# EAGLE design modtest (EAGLE 9.6.2)
Assembly variants: basic

## Sheet 1 of 2: Measuring part and main connector
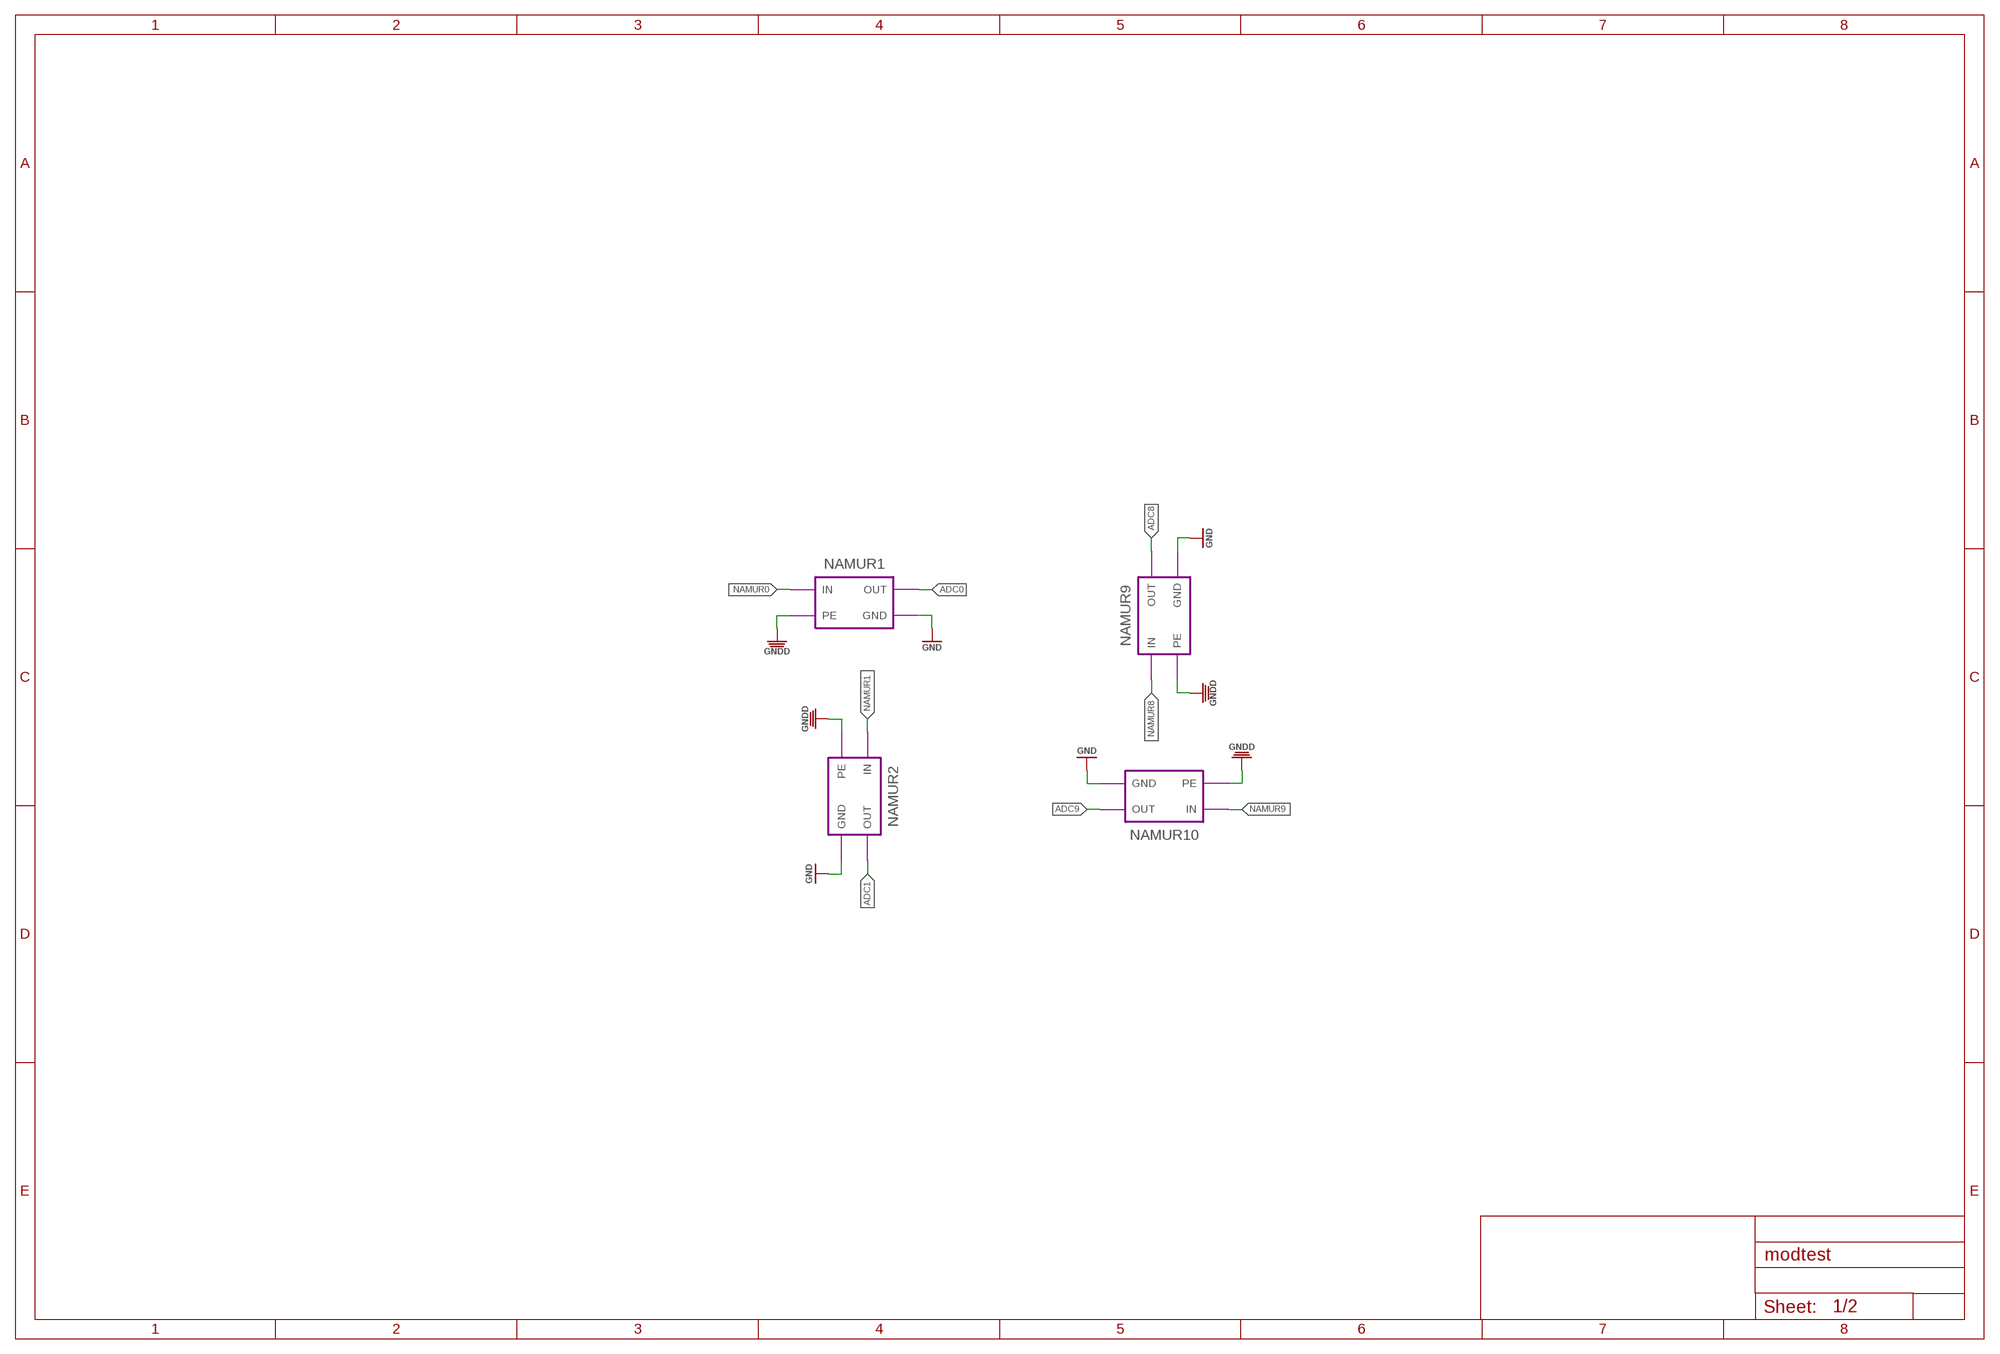
[diagram p0: schematic, sheet 1]

### Module instances
NAMUR1 = NAMUR (part numbers offset by 100)
NAMUR2 = NAMUR (part numbers offset by 200)
NAMUR9 = NAMUR (part numbers offset by 900)
NAMUR10 = NAMUR (part numbers offset by 1000)

### Nets
ADC0: port NAMUR1.OUT ; also sheet 2
ADC1: port NAMUR2.OUT ; also sheet 2
ADC8: port NAMUR9.OUT ; also sheet 2
ADC9: port NAMUR10.OUT ; also sheet 2
GND: port NAMUR1.GND NAMUR2.GND NAMUR9.GND NAMUR10.GND ; also sheet 2
GNDD: port NAMUR1.PE NAMUR2.PE NAMUR9.PE NAMUR10.PE ; also sheet 2
NAMUR0: port NAMUR1.IN ; also sheet 2
NAMUR1: port NAMUR2.IN ; also sheet 2
NAMUR8: port NAMUR9.IN ; also sheet 2
NAMUR9: port NAMUR10.IN ; also sheet 2

## Sheet 2 of 2
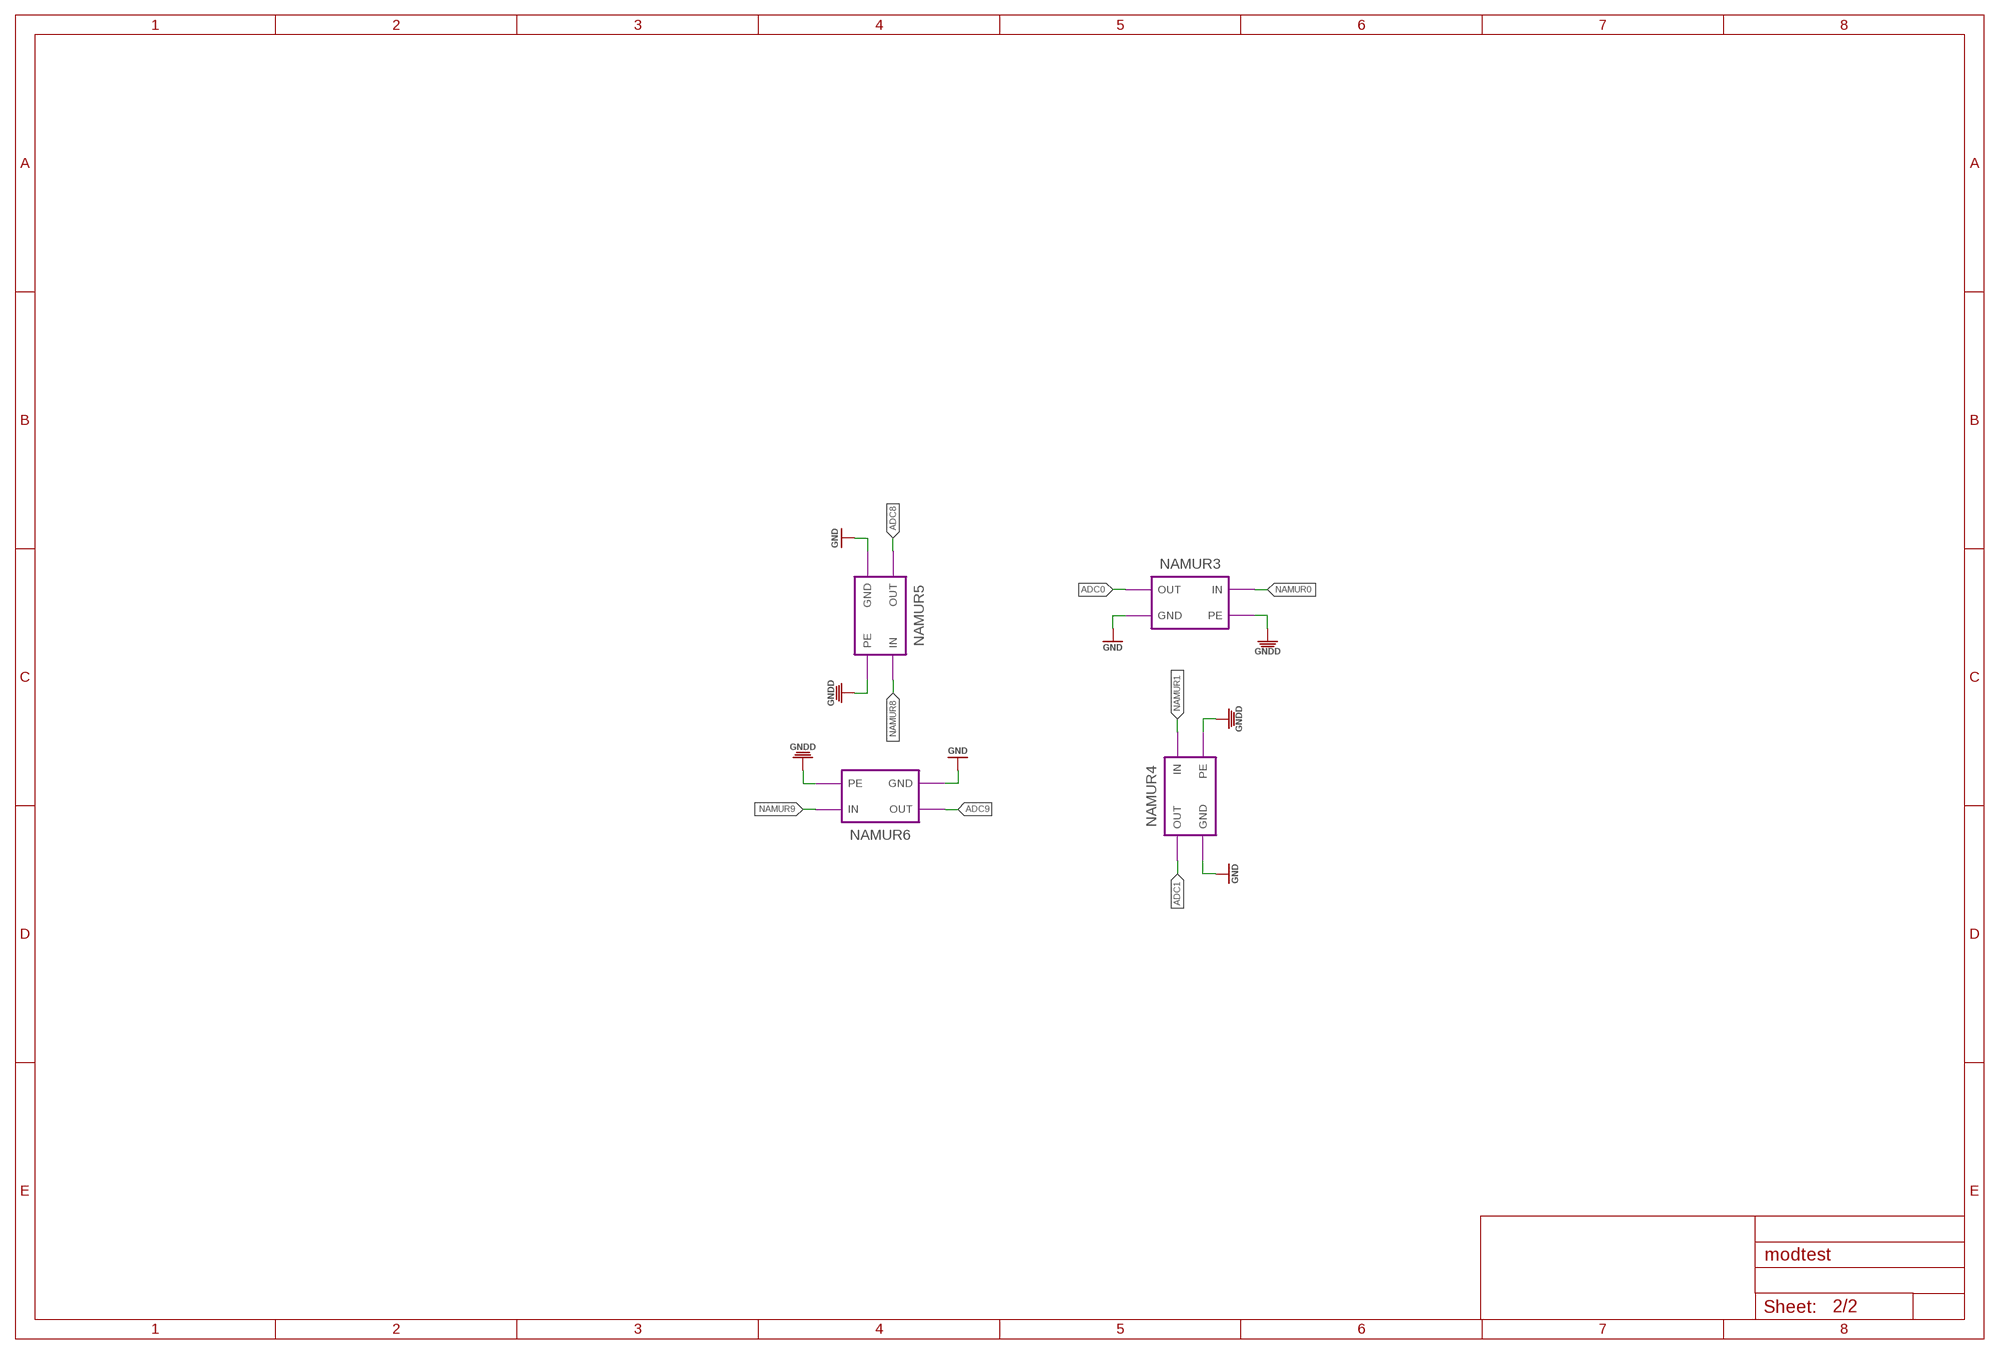
[diagram p1: schematic, sheet 2]

### Module instances
NAMUR3 = NAMUR
NAMUR4 = NAMUR
NAMUR5 = NAMUR
NAMUR6 = NAMUR

### Nets
ADC0: port NAMUR3.OUT ; also sheet 1
ADC1: port NAMUR4.OUT ; also sheet 1
ADC8: port NAMUR5.OUT ; also sheet 1
ADC9: port NAMUR6.OUT ; also sheet 1
GND: port NAMUR3.GND NAMUR4.GND NAMUR5.GND NAMUR6.GND ; also sheet 1
GNDD: port NAMUR3.PE NAMUR4.PE NAMUR5.PE NAMUR6.PE ; also sheet 1
NAMUR0: port NAMUR3.IN ; also sheet 1
NAMUR1: port NAMUR4.IN ; also sheet 1
NAMUR8: port NAMUR5.IN ; also sheet 1
NAMUR9: port NAMUR6.IN ; also sheet 1

## Library data of the parts

## Module NAMUR
Ports: GND(pwr) IN(in) OUT(out) PE(pwr)
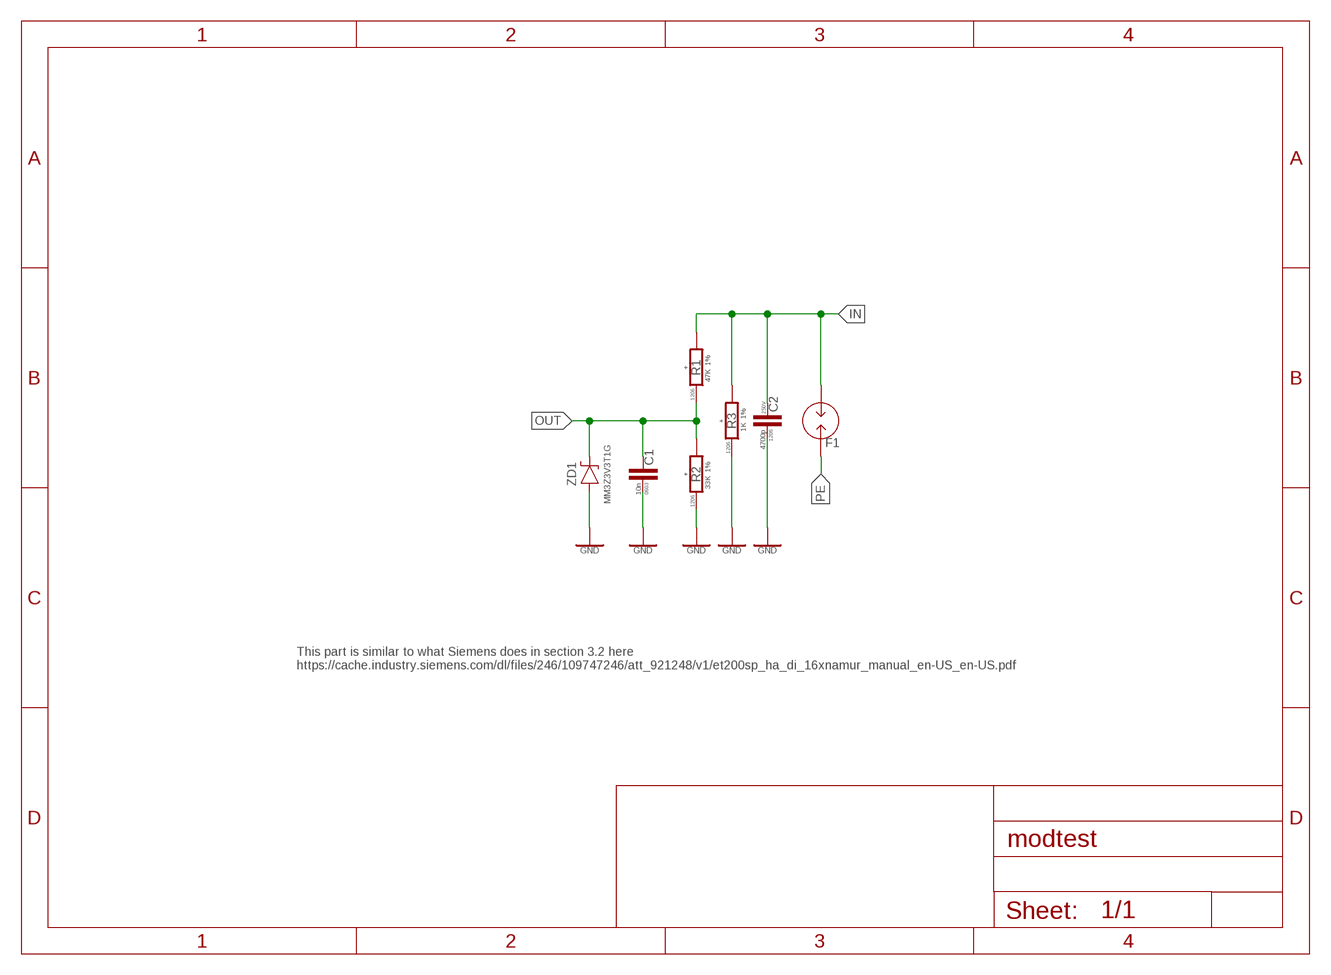
[diagram p2: schematic, module NAMUR, sheet 1]

### Parts
C1  10n  C-0603  [C0603]
C2  4700p  C-1206  [C1206]
F1  SURGE_ARRESTER-S30-A90X  [S30-A90X]
R1  47K  R-1%-1206  [R1206]
R2  33K  R-1%-1206  [R1206]
R3  1K  R-1%-1206  [R1206]
ZD1  MM3Z3V3  [SOD323]

### Nets
GND: C1.1 C2.P$1 R2.P$1 R3.P$1 ZD1.A
IN: C2.P$2 F1.1 R1.P$2 R3.P$2
OUT: C1.2 R1.P$1 R2.P$2 ZD1.C
PE: F1.2

### Notes on the sheet
- This part is similar to what Siemens does in section 3.2 here
  https://cache.industry.siemens.com/dl/files/246/109747246/att_921248/v1/et200sp_ha_di_16xnamur_manual_en-US_en-US.pdf

### Library data of the parts
C1 = rc:C; PACKAGE: 0603; RU: Конденсатор керамический SMD 0603
C2 = rc:C; PACKAGE: 1206; RU: Конденсатор керамический SMD 1206; VOLTAGE: 250V
F1 = rc:SURGE_ARRESTER: S30-A90X Surge arrester; CODE: 00000040342; LCSC#: C3660985; MANF: TDK; MANF#: B88069X9231T253; RU: Газоразрядник S30-A90X (90V, 2kA, 2 вывода, SMD1812)
R1-R3 = rc:R; ALLOCATED: +; PACKAGE: 1206; TOLERANCE: 1%
ZD1 = Diodes:MM3Z: Zener Diode 200-300mW ±6% Surface Mount SOD-323 (or SOD-323FL); LCSC#: C75073; MANF: onsemi; MANF#: MM3Z3V3T1G

## Net classes
1 HV: clearance 0.3 mm to class 0, clearance 0.3 mm

## Board
ВНАР.301411.138 Сателлит-Р. Плата субблока ВТИ-8 (Р05)
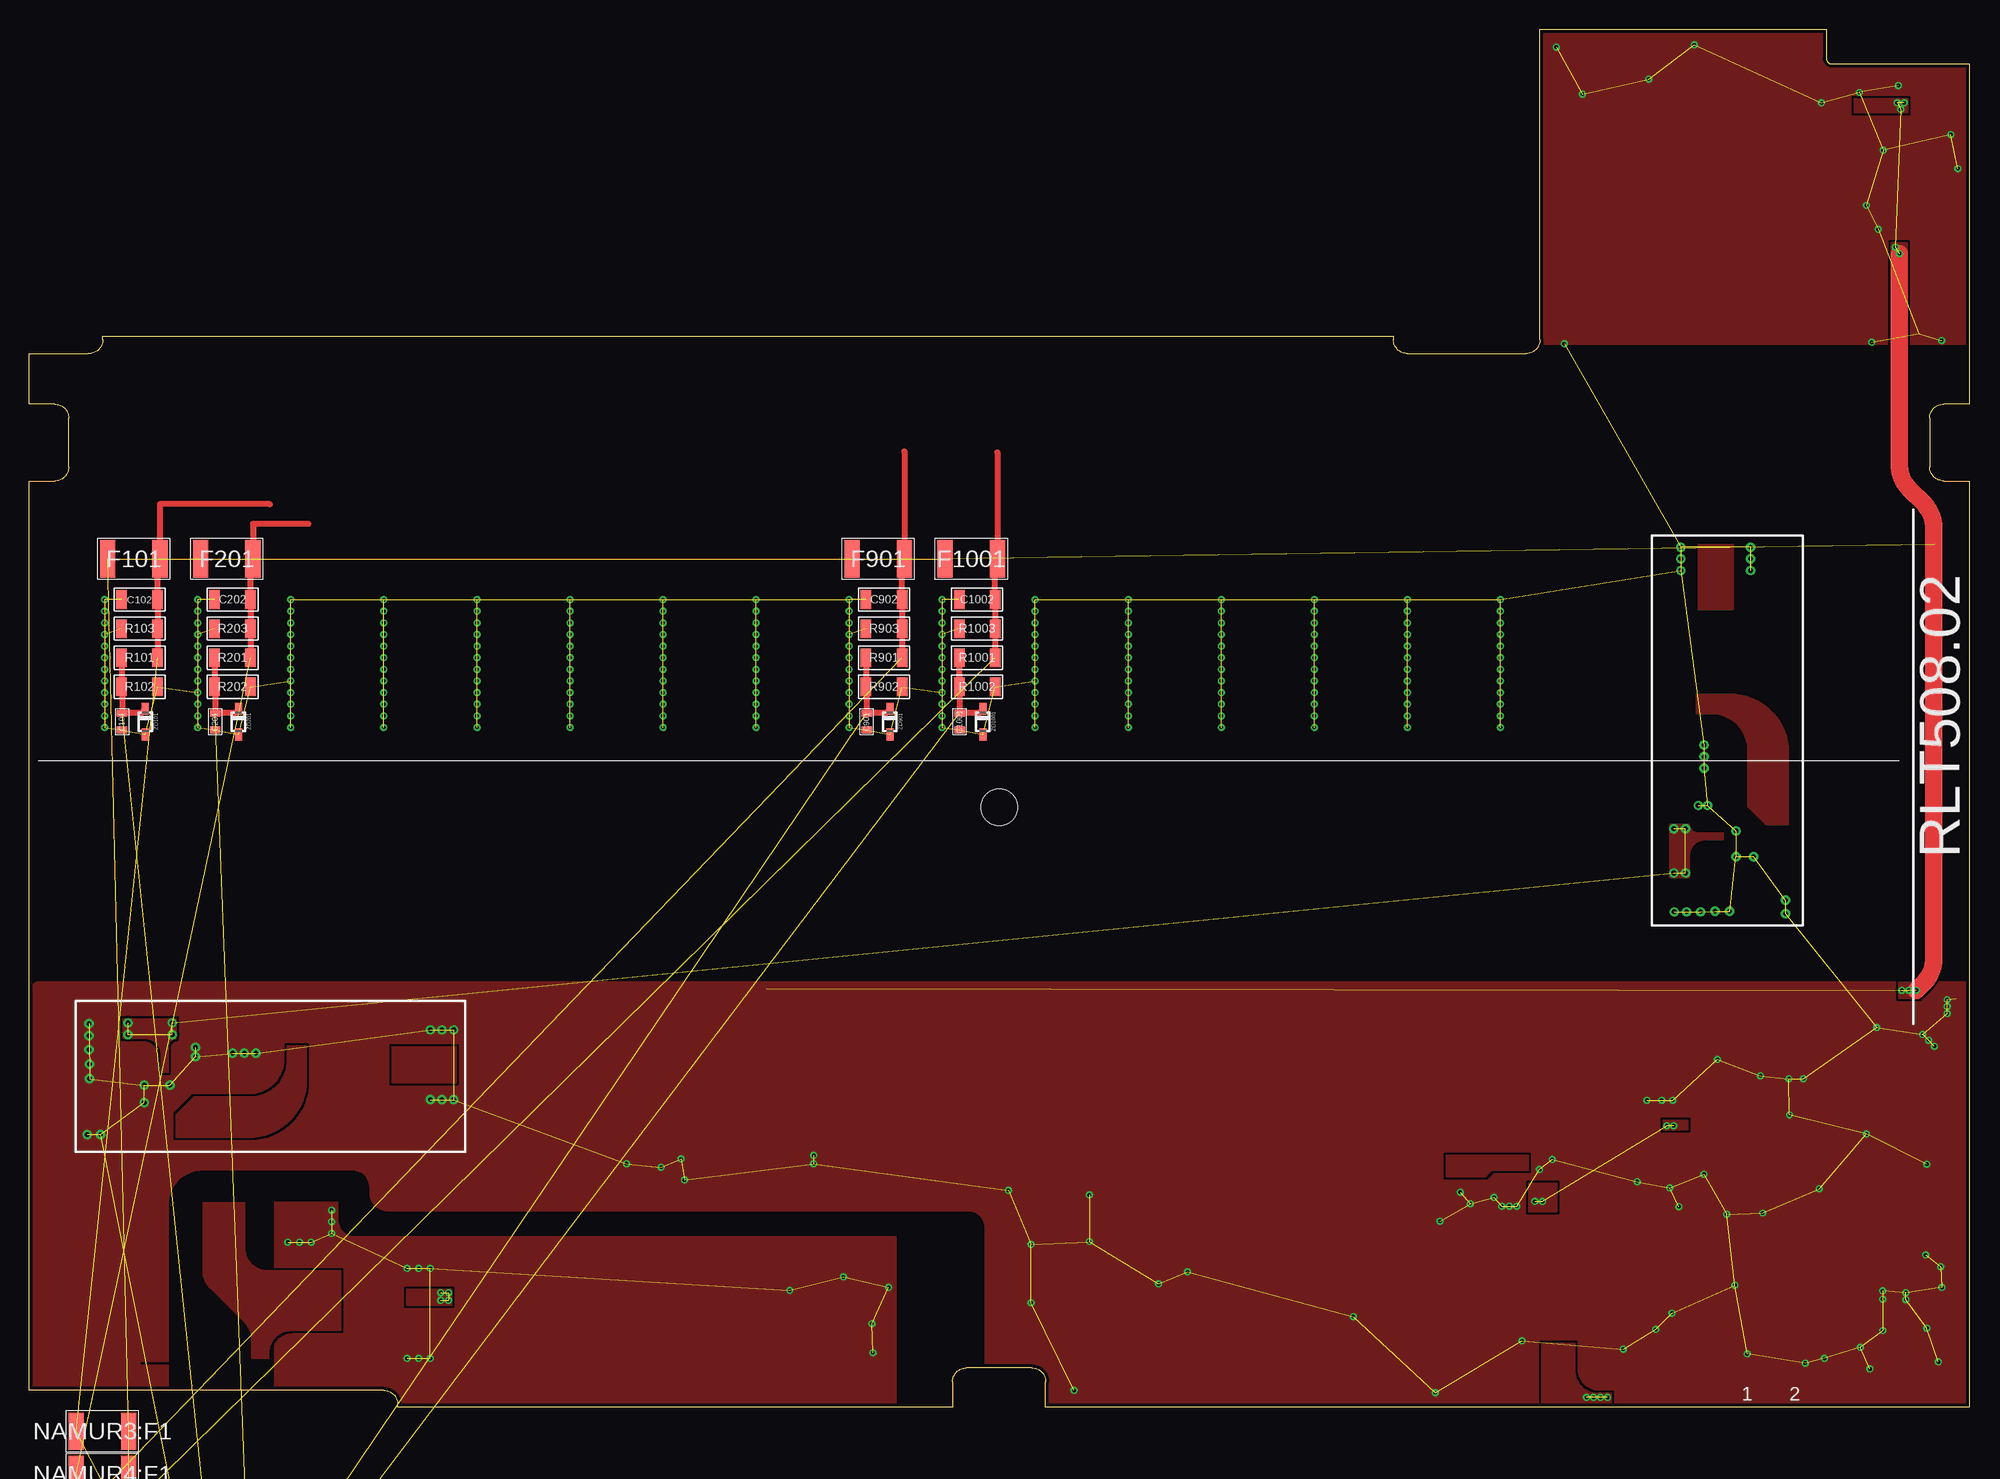
[diagram p3: board, top side]
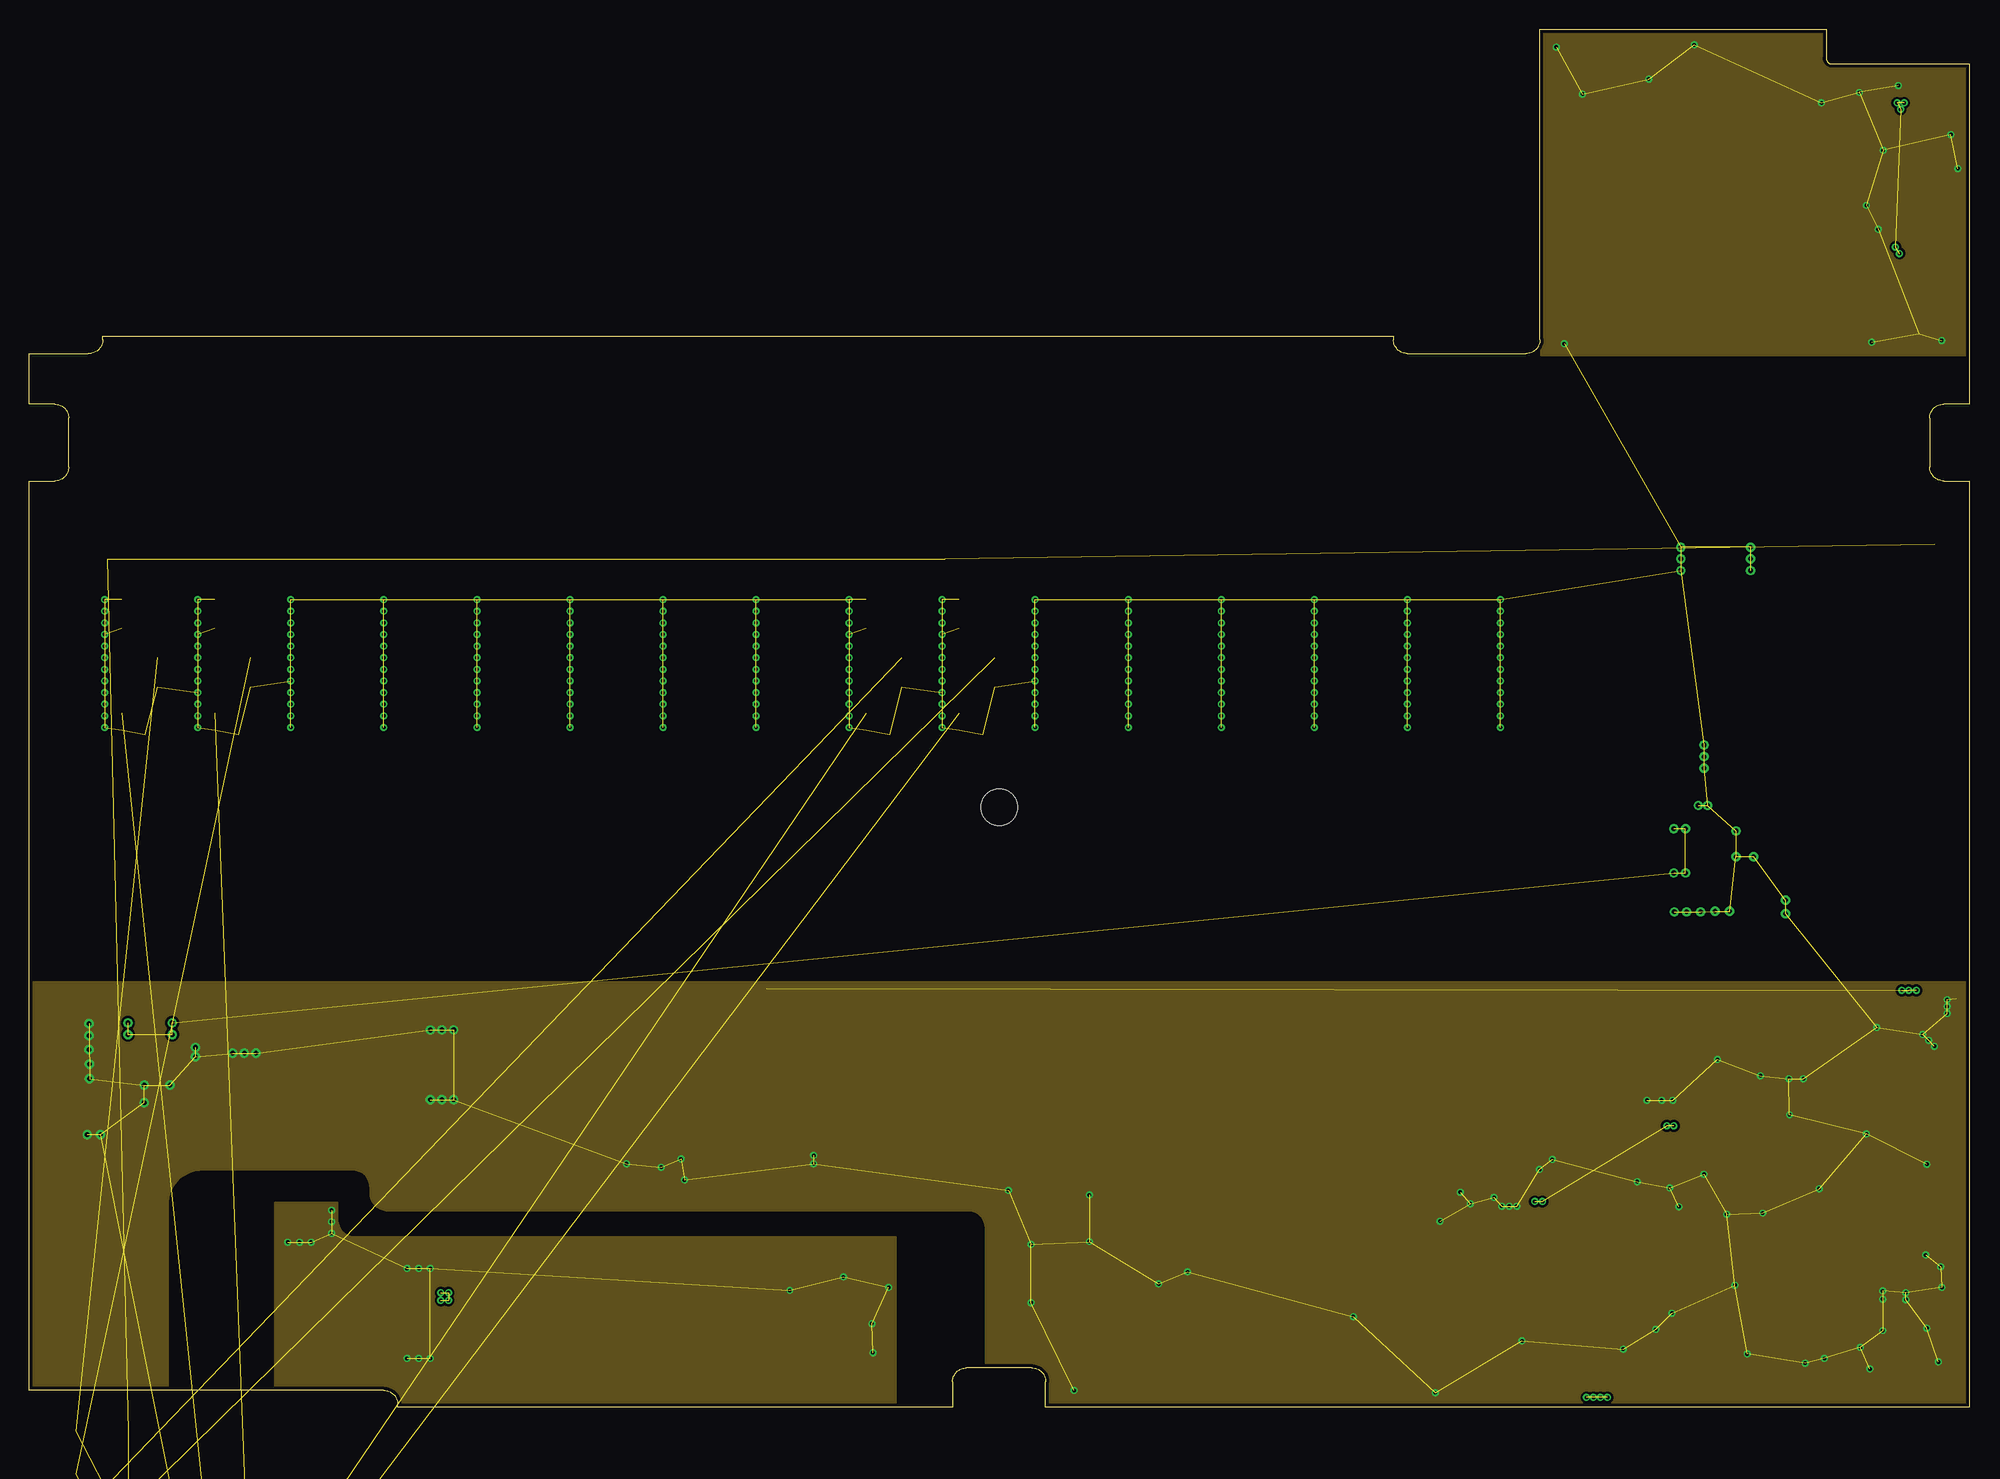
[diagram p4: board, inner layer Route2]
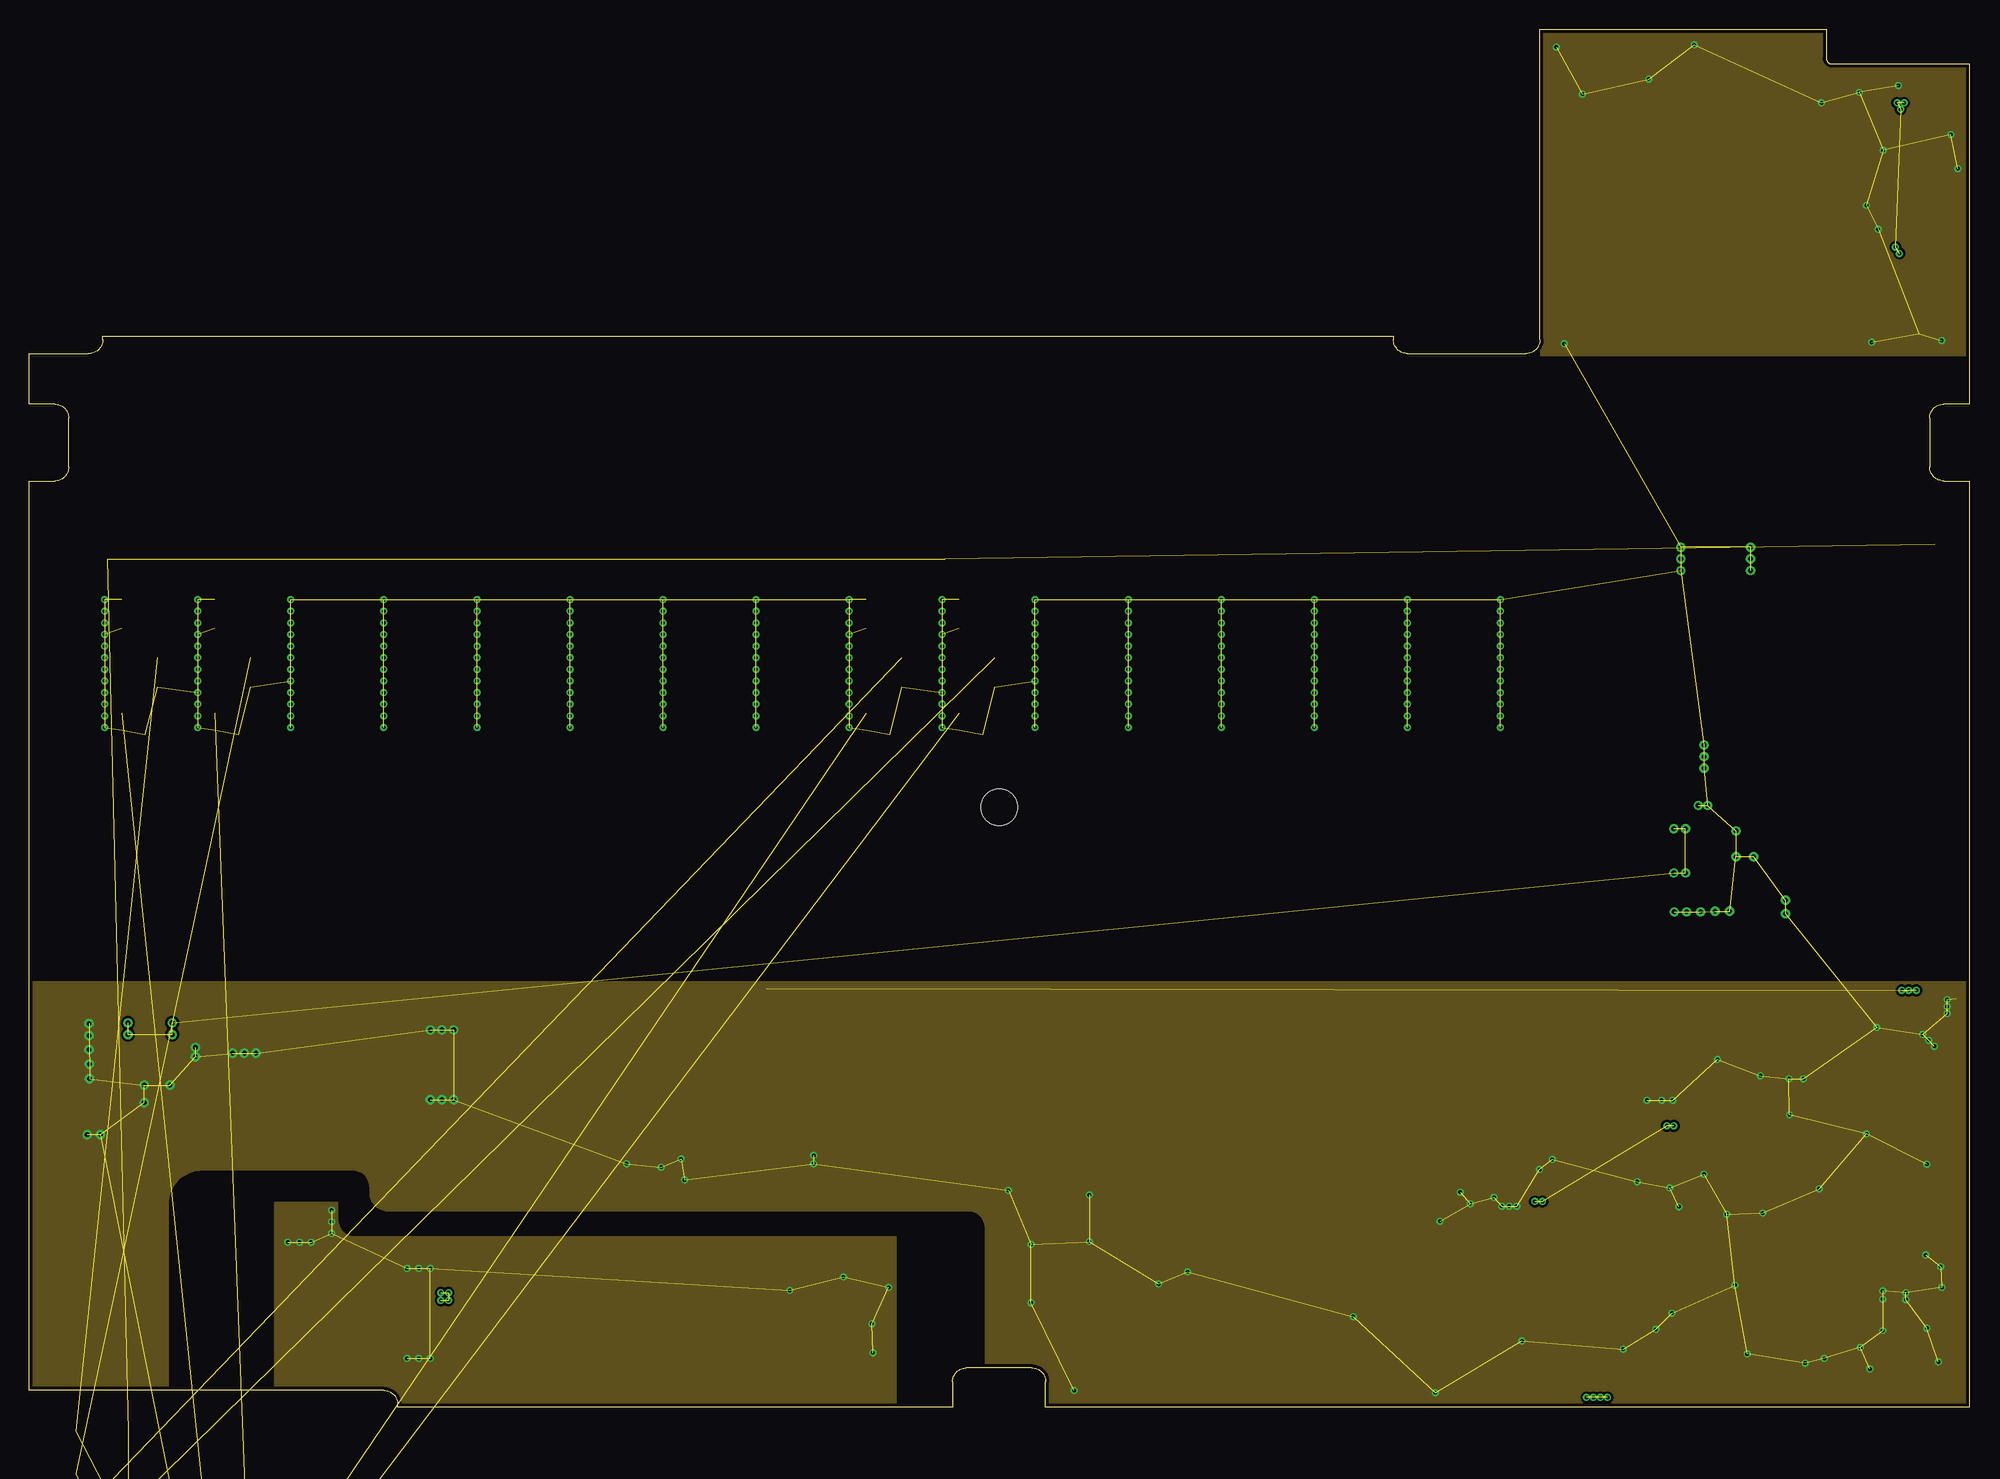
[diagram p5: board, inner layer Route15]
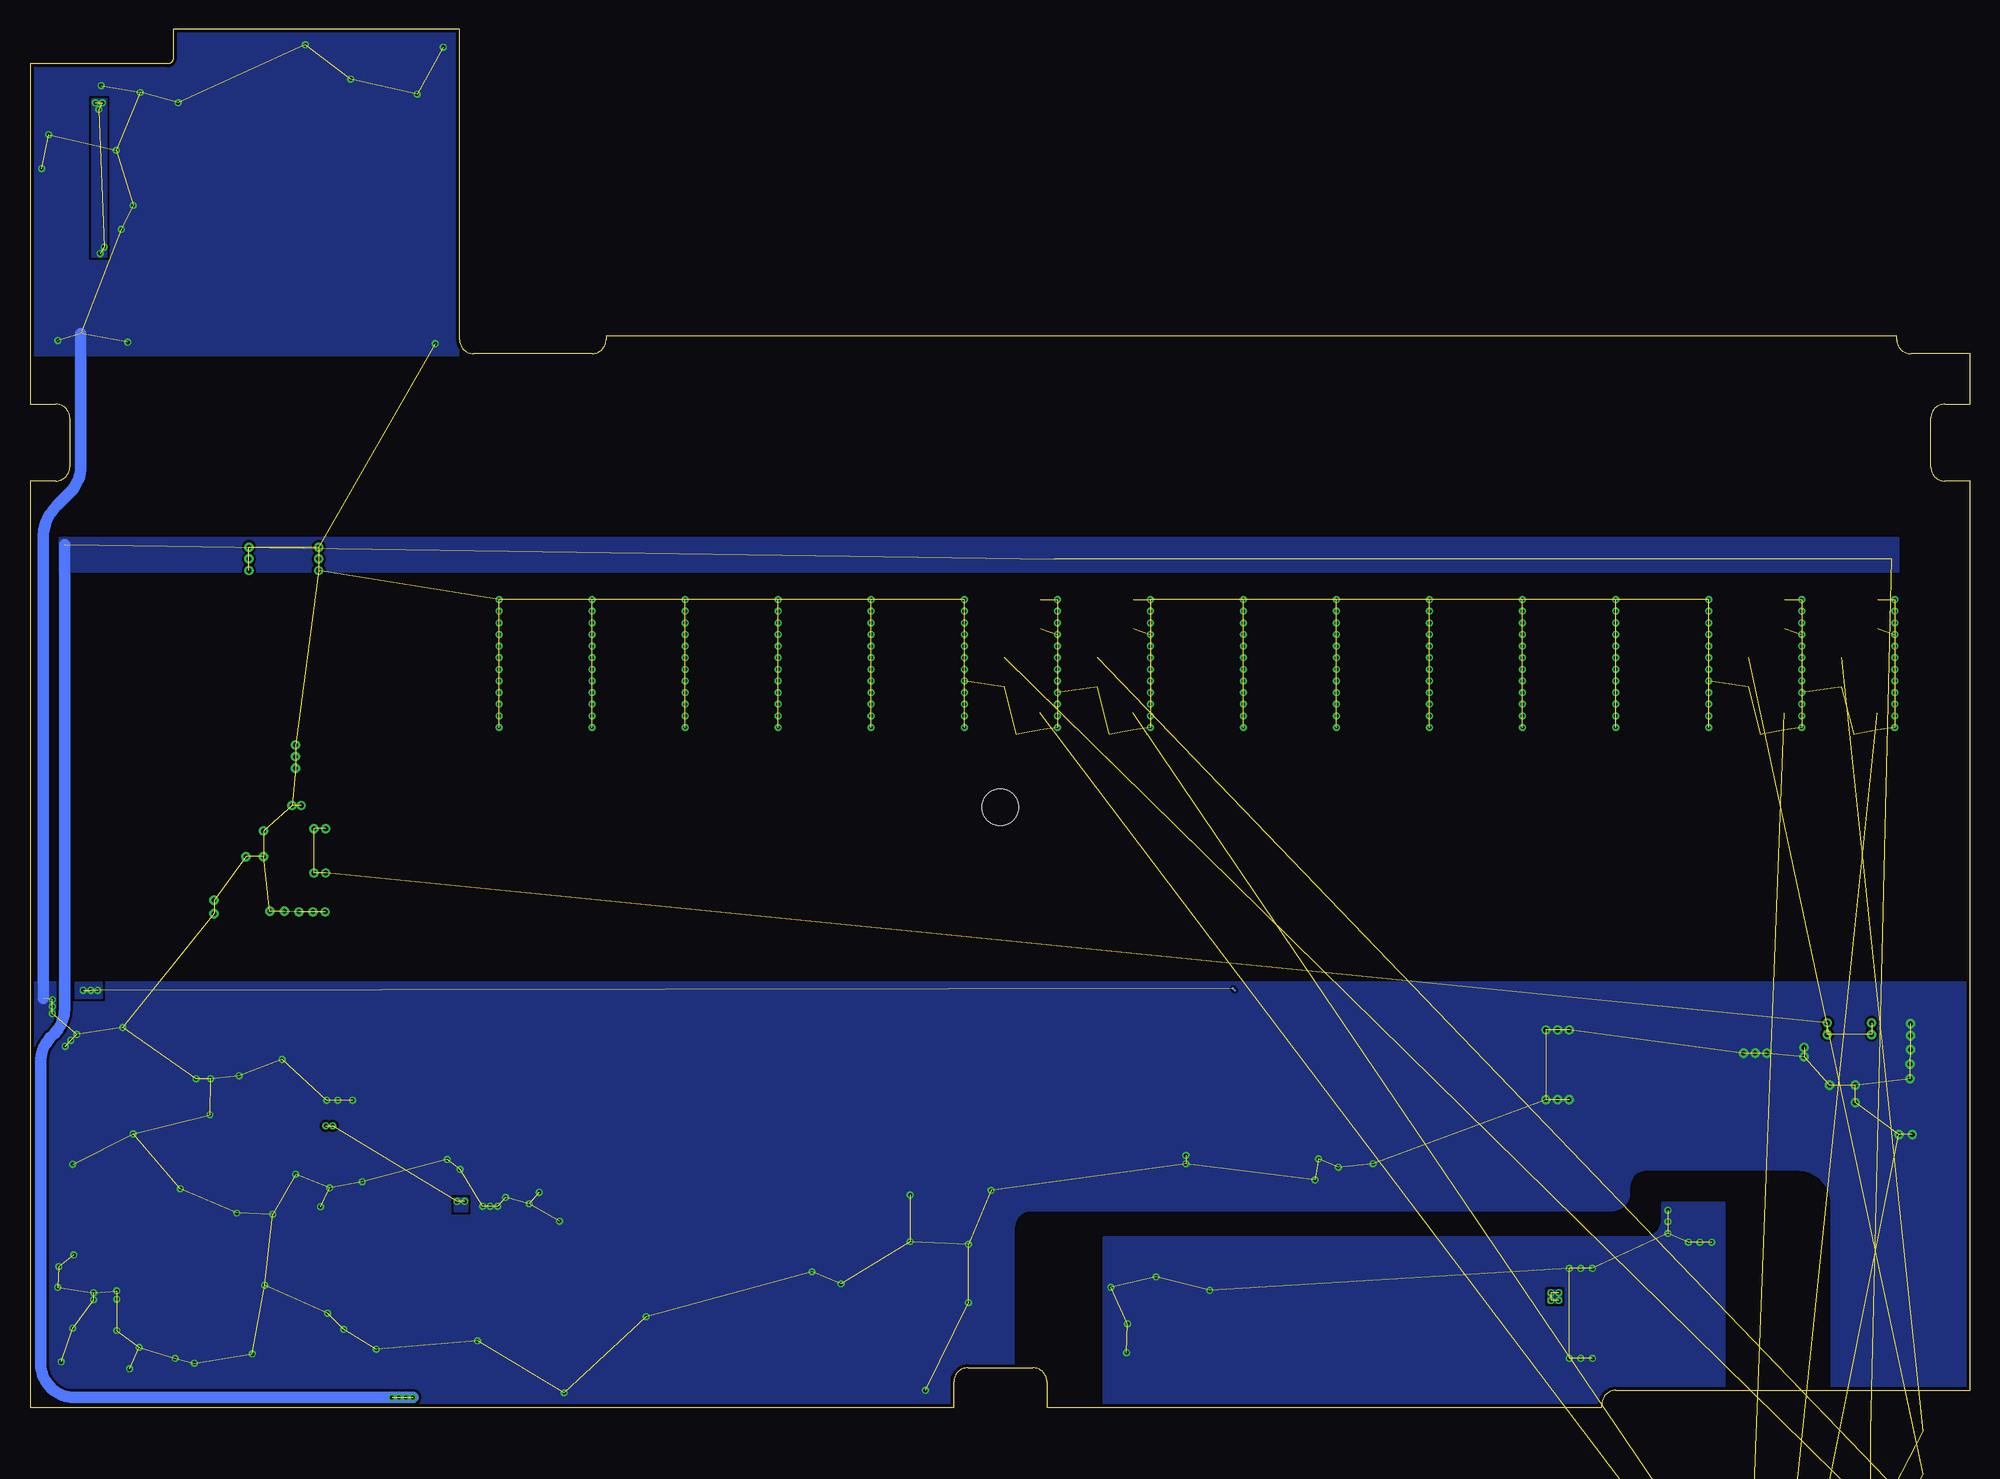
[diagram p6: board, bottom side, seen from below]

Size 166.8 x 118.5 mm. Coordinates in mm from the lower left corner, seen from the top.
Outline: 0,90.6 5.1,90.6 arc90 6.35,91.8 6.35,92.1 117.3,92.1 117.3,91.8 arc90 118.5,90.6 128.7,90.6 arc90 129.9,91.8 129.9,118.5 154.5,118.5 154.5,116 arc90 155,115.5 166.8,115.5 166.8,86.25 164.6,86.25 arc90 163.4,85.05 163.4,80.85 arc90 164.6,79.65 166.8,79.65 166.8,0 87.4,0 87.4,2.2 arc90 86.2,3.4 80.6,3.4 arc90 79.4,2.2 79.4,0 31.7,0 31.7,0.25 arc90 30.5,1.45 0,1.45 0,79.65 2.2,79.65 arc90 3.4,80.85 3.4,85.05 arc90 2.2,86.25 0,86.25 0,90.6
Copper layers (1+2*15+16): Top 0.035mm / dielectric 1.43mm / Route2 0.035mm / dielectric 0.15mm / Route15 0.035mm / dielectric 0.2mm / Bottom 0.035mm
Design rules "Rezonit 2 layer *": minimum track width 6mil, minimum drill 0.3mm, track to track 0.2mm, track to pad 0.2mm, pad to pad 0.2mm, via to via 0.2mm, smd to smd 0.2mm, copper to edge 0.3mm, drill to drill 6mil, minimum pad ring 0.15mm, minimum via ring 0.15mm, stop-mask expansion 0.05mm, vias tented up to drill 0.5mm, thermal gap 10mil
Holes 3.1 mm at 83.4,51.6
tRestrict: 1 lines

### Footprints (pad centres in the part's own frame; a part is rotated, then mirrored left to right if it is on the bottom)
C0603 = smd 0.6 x 0.9: 1 -0.725,0; 2 0.725,0
C1206 = smd 0.9 x 1.6: P$1 -1.55,0; P$2 1.55,0
S30-A90X = smd 1.3 x 3.2: 1 -2.25,0; 2 2.25,0
R1206 = smd 0.9 x 1.6: P$1 -1.55,0; P$2 1.55,0
SOD323 = smd 1 x 0.6: A -1.1,0; C 1.1,0

### Placement (x,y rotation side)
C101  10n  [C0603]  8,58.95 90 top
C102  4700p  [C1206]  9.5,69.45 0 top
C201  10n  [C0603]  16,58.95 90 top
C202  4700p  [C1206]  17.5,69.45 0 top
C901  10n  [C0603]  72,58.95 90 top
C902  4700p  [C1206]  73.5,69.45 0 top
C1001  10n  [C0603]  80,58.95 90 top
C1002  4700p  [C1206]  81.5,69.45 0 top
F101  SURGE_ARRESTER-S30-A90X  [S30-A90X]  9,72.95 180 top
F201  SURGE_ARRESTER-S30-A90X  [S30-A90X]  17,72.95 180 top
F901  SURGE_ARRESTER-S30-A90X  [S30-A90X]  73,72.95 180 top
F1001  SURGE_ARRESTER-S30-A90X  [S30-A90X]  81,72.95 180 top
NAMUR3:C1  10n  [C0603]  14,-27.25 0 top  (outside the outline)
NAMUR3:C2  4700p  [C1206]  9.3,-25.15 0 top  (outside the outline)
NAMUR3:F1  SURGE_ARRESTER-S30-A90X  [S30-A90X]  6.3,-2.05 0 top
NAMUR3:R1  47K  [R1206]  9.8,-16.15 0 top  (outside the outline)
NAMUR3:R2  33K  [R1206]  16.2,-16.15 0 top  (outside the outline)
NAMUR3:R3  1K  [R1206]  3.1,-18.55 0 top  (outside the outline)
NAMUR3:ZD1  MM3Z3V3  [SOD323]  14.4,-12.35 0 top  (outside the outline)
NAMUR4:C1  10n  [C0603]  18.3,-27.25 0 top  (outside the outline)
NAMUR4:C2  4700p  [C1206]  15.3,-25.15 0 top  (outside the outline)
NAMUR4:F1  SURGE_ARRESTER-S30-A90X  [S30-A90X]  6.3,-5.75 0 top  (outside the outline)
NAMUR4:R1  47K  [R1206]  9.5,-18.55 0 top  (outside the outline)
NAMUR4:R2  33K  [R1206]  15.9,-18.55 0 top  (outside the outline)
NAMUR4:R3  1K  [R1206]  3.1,-20.75 0 top  (outside the outline)
NAMUR4:ZD1  MM3Z3V3  [SOD323]  17.7,-12.35 0 top  (outside the outline)
NAMUR5:C1  10n  [C0603]  2.1,-29.45 0 top  (outside the outline)
NAMUR5:C2  4700p  [C1206]  2.9,-27.35 0 top  (outside the outline)
NAMUR5:F1  SURGE_ARRESTER-S30-A90X  [S30-A90X]  6.3,-9.45 0 top  (outside the outline)
NAMUR5:R1  47K  [R1206]  9.5,-20.75 0 top  (outside the outline)
NAMUR5:R2  33K  [R1206]  15.9,-20.75 0 top  (outside the outline)
NAMUR5:R3  1K  [R1206]  3.1,-22.95 0 top  (outside the outline)
NAMUR5:ZD1  MM3Z3V3  [SOD323]  1.6,-16.05 0 top  (outside the outline)
NAMUR6:C1  10n  [C0603]  6.4,-29.45 0 top  (outside the outline)
NAMUR6:C2  4700p  [C1206]  8.9,-27.35 0 top  (outside the outline)
NAMUR6:F1  SURGE_ARRESTER-S30-A90X  [S30-A90X]  6.3,-13.15 0 top  (outside the outline)
NAMUR6:R1  47K  [R1206]  9.5,-22.95 0 top  (outside the outline)
NAMUR6:R2  33K  [R1206]  15.9,-22.95 0 top  (outside the outline)
NAMUR6:R3  1K  [R1206]  3.1,-25.15 0 top  (outside the outline)
NAMUR6:ZD1  MM3Z3V3  [SOD323]  4.9,-16.05 0 top  (outside the outline)
R101  47K  [R1206]  9.5,64.45 0 top
R102  33K  [R1206]  9.5,61.95 180 top
R103  1K  [R1206]  9.5,66.95 0 top
R201  47K  [R1206]  17.5,64.45 0 top
R202  33K  [R1206]  17.5,61.95 180 top
R203  1K  [R1206]  17.5,66.95 0 top
R901  47K  [R1206]  73.5,64.45 0 top
R902  33K  [R1206]  73.5,61.95 180 top
R903  1K  [R1206]  73.5,66.95 0 top
R1001  47K  [R1206]  81.5,64.45 0 top
R1002  33K  [R1206]  81.5,61.95 180 top
R1003  1K  [R1206]  81.5,66.95 0 top
ZD101  MM3Z3V3  [SOD323]  10,58.95 90 top
ZD201  MM3Z3V3  [SOD323]  18,58.95 90 top
ZD901  MM3Z3V3  [SOD323]  74,58.95 90 top
ZD1001  MM3Z3V3  [SOD323]  82,58.95 90 top

### Tracks (layer width: path | path; a pad name or v marks a point on that pad's centre or on a via)
ADC0  (4 unrouted)
  Top 0.5: R101.P$1 R102.P$2 8,61.9 C101.2 9.62,59.68 ZD101.C
ADC1  (4 unrouted)
  Top 0.5: R201.P$1 R202.P$2 16,61.9 C201.2 17.62,59.68 ZD201.C
ADC8  (4 unrouted)
  Top 0.5: R901.P$1 R902.P$2 72,61.9 C901.2 73.62,59.68 ZD901.C
ADC9  (4 unrouted)
  Top 0.5: R1001.P$1 R1002.P$2 80,61.9 C1001.2 81.62,59.68 ZD1001.C
DIN  (via drill 0.4 pad 0.8)  (7 unrouted)
  other vias: 8.5,32.05 8.5,33.05 12.3,32.05 12.3,33.05 142.4,45.95 141.4,45.95 142.4,49.75 141.4,49.75
  pour Top (no thermals): 11.9,28.85 11.9,31.05 arc-90 12.6,31.75 12.6,33.35 8.15,33.35 8.15,31.75 10,31.75 arc-90 11.4,30.35 11.4,28.85
  pour Top (no thermals): 145.6,49.35 143.4,49.35 arc-90 142.7,50.05 141.1,50.05 141.1,45.6 142.7,45.6 142.7,47.45 arc-90 144.1,48.85 145.6,48.85
GND  (via drill 0.3 pad 0.6, 0.4 pad 0.8)  (358 unrouted)
  Bottom 1: 162.45,92.3 162.45,80.91 arc45 163.38,78.67 164.52,77.53 arc-45 165.7,74.68 165.7,35.15
  other vias: 151.35,25.15 152.55,28.25 151.3,28.25 145.15,29.9 141.3,26.4 140.35,26.4 139.1,26.4 138.25,19.4 152.7,3.8 137.05,5 127.9,17.3 127.25,17.3 126.6,17.3 125.95,18.05 129.85,20.45 130.95,21.3 153.9,18.8 123.9,17.5 123.05,18.5 121.3,16 91.15,18.25 91.15,14.25 67.45,20.95 67.45,21.65 56.35,19.55 56.05,21.35 54.35,20.65 51.35,20.95 141.25,8.1 148.85,28.5 157.45,5.15 157.95,23.5 144,20.05 154.35,4.2 163.15,20.9 159.35,10 159.35,9.3 161.35,9.85 161.35,9.25 164.45,10.3 164.35,12.1 163.05,13.1 163.15,6.8 159.35,6.6 164.15,3.9 139.85,6.7 158.25,3.3 158.85,32.65 160.7,113.65 154.1,112.15 157.35,113.05 164.9,35.05 164.9,34.45 162.8,32.05 164.9,33.85 163.3,31.55 163.8,31.05 165.22,109.42 157.95,103.34 131.3,116.95 143.15,117.15 139.25,114.2 133.55,112.9 159.4,108.08 86.15,14 86.15,9 89.85,1.45 120.9,1.25 128.35,5.7 113.85,7.8 97.1,10.6 99.6,11.65 84.2,18.65 147.7,4.6 141.05,18.85 141.85,17.25 146.65,10.5 149.05,16.7 145.95,16.6 158.98,101.29 131.97,91.45 158.4,91.58 164.43,91.73 165.82,106.5 6.5,69.45 6.5,68.45 6.5,67.45 6.5,66.45 6.5,65.45 6.5,64.45 6.5,63.45 6.5,62.45 6.5,61.45 6.5,60.45 6.5,59.45 6.5,58.45 14.5,69.45 14.5,68.45 14.5,67.45 14.5,66.45 14.5,65.45 14.5,64.45 14.5,63.45 14.5,62.45 14.5,61.45 14.5,60.45 14.5,59.45 14.5,58.45 22.5,69.45 22.5,68.45 22.5,67.45 22.5,66.45 22.5,65.45 22.5,64.45 22.5,63.45 22.5,62.45 22.5,61.45 22.5,60.45 22.5,59.45 22.5,58.45 30.5,69.45 30.5,68.45 30.5,67.45 30.5,66.45 30.5,65.45 30.5,64.45 30.5,63.45 30.5,62.45 30.5,61.45 30.5,60.45 30.5,59.45 30.5,58.45 46.5,69.45 46.5,68.45 46.5,67.45 46.5,66.45 46.5,65.45 46.5,64.45 46.5,63.45 46.5,62.45 46.5,61.45 46.5,60.45 46.5,59.45 46.5,58.45 54.5,69.45 54.5,68.45 54.5,67.45 54.5,66.45 54.5,65.45 54.5,64.45 54.5,63.45 54.5,62.45 54.5,61.45 54.5,60.45 54.5,59.45 54.5,58.45 62.5,69.45 62.5,68.45 62.5,67.45 62.5,66.45 62.5,65.45 62.5,64.45 62.5,63.45 62.5,62.45 62.5,61.45 62.5,60.45 62.5,59.45 62.5,58.45 70.5,69.45 70.5,68.45 70.5,67.45 70.5,66.45 70.5,65.45 70.5,64.45 70.5,63.45 70.5,62.45 70.5,61.45 70.5,60.45 70.5,59.45 70.5,58.45 78.5,69.45 78.5,68.45 78.5,67.45 78.5,66.45 78.5,65.45 78.5,64.45 78.5,63.45 78.5,62.45 78.5,61.45 78.5,60.45 78.5,59.45 78.5,58.45 86.5,69.45 86.5,68.45 86.5,67.45 86.5,66.45 86.5,65.45 86.5,64.45 86.5,63.45 86.5,62.45 86.5,61.45 86.5,60.45 86.5,59.45 86.5,58.45 94.5,69.45 94.5,68.45 94.5,67.45 94.5,66.45 94.5,65.45 94.5,64.45 94.5,63.45 94.5,62.45 94.5,61.45 94.5,60.45 94.5,59.45 94.5,58.45 102.5,69.45 102.5,68.45 102.5,67.45 102.5,66.45 102.5,65.45 102.5,64.45 102.5,63.45 102.5,62.45 102.5,61.45 102.5,60.45 102.5,59.45 102.5,58.45 110.5,69.45 110.5,68.45 110.5,67.45 110.5,66.45 110.5,65.45 110.5,64.45 110.5,63.45 110.5,62.45 110.5,61.45 110.5,60.45 110.5,59.45 110.5,58.45 118.5,69.45 118.5,68.45 118.5,67.45 118.5,66.45 118.5,65.45 118.5,64.45 118.5,63.45 118.5,62.45 118.5,61.45 118.5,60.45 118.5,59.45 118.5,58.45 38.5,69.45 38.5,68.45 38.5,67.45 38.5,66.45 38.5,65.45 38.5,64.45 38.5,63.45 38.5,62.45 38.5,61.45 38.5,60.45 38.5,59.45 38.5,58.45 126.5,69.45 126.5,68.45 126.5,67.45 126.5,66.45 126.5,65.45 126.5,64.45 126.5,63.45 126.5,62.45 126.5,61.45 126.5,60.45 126.5,59.45 126.5,58.45 5.15,33 5.15,31.95 14.3,30.95 14.3,30.15 18.5,30.45 19.5,30.45 17.5,30.45 36.5,26.45 35.5,26.45 34.5,26.45 34.5,32.45 35.5,32.45 36.5,32.45 9.9,27.7 9.9,26.2 12.1,27.7 5.2,28.25 5.2,29.5 5.15,30.75 6.15,23.45 5,23.45 141.45,42.6 142.5,42.6 143.5,51.75 144.3,51.75 144,55.95 144,56.95 144,54.95 148,73.95 148,72.95 148,71.95 142,71.95 142,72.95 142,73.95 146.75,47.35 148.25,47.35 146.75,49.55 146.2,42.65 144.95,42.65 143.7,42.6 151,43.6 151,42.45
  pour Bottom (rank 3): 11.9,1.45 0,1.45 0,36.55 166.8,36.55 166.8,0 82.25,0 82.25,15.45 arc90 80.75,16.95 30.85,16.95 arc-90 29.35,18.45 29.35,18.95 arc90 27.85,20.45 14.9,20.45 arc90 11.9,17.45
  pour Top (rank 3): 11.9,1.45 0,1.45 0,35.55 arc-90 1,36.55 166.8,36.55 166.8,0 82.25,0 82.25,15.45 arc90 80.75,16.95 30.85,16.95 arc-90 29.35,18.45 29.35,18.95 arc90 27.85,20.45 14.9,20.45 arc90 11.9,17.45
  pour Top (rank 2): 130,118.5 130,91.45 166.8,91.45 166.8,118.5
  pour Bottom (rank 2): 130,118.5 130,90.45 166.8,90.45 166.8,118.5
  pour Route2: 130,118.5 130,90.45 166.8,90.45 166.8,118.5
  pour Route15: 130,118.5 130,90.45 166.8,90.45 166.8,118.5
  pour Route15 (rank 3): 11.9,1.45 0,1.45 0,36.55 166.8,36.55 166.8,0 82.25,0 82.25,15.45 arc90 80.75,16.95 30.85,16.95 arc-90 29.35,18.45 29.35,18.95 arc90 27.85,20.45 14.9,20.45 arc90 11.9,17.45
  pour Route2 (rank 3): 11.9,1.45 0,1.45 0,36.55 166.8,36.55 166.8,0 82.25,0 82.25,15.45 arc90 80.75,16.95 30.85,16.95 arc-90 29.35,18.45 29.35,18.95 arc90 27.85,20.45 14.9,20.45 arc90 11.9,17.45
GNDD  (via drill 0.3 pad 0.6)  (11 unrouted)
  Bottom 1: v133.9,0.85 163,0.85 arc90 165.9,3.75 165.9,29.71 arc45 165.02,31.83 164.73,32.12 arc-45 163.85,34.24 163.85,74.16
  other vias: 134.5,0.85 135.1,0.85 135.7,0.85
  pour Top (no thermals): 136,0.3 130.1,0.3 130.1,5.45 132.85,5.45 132.85,3.15 arc90 134.85,1.15 136,1.15
  pour Bottom (no thermals): 164.25,74.75 6.2,74.75 6.2,71.85 164.25,71.85
ISO24V
  pour Top (no thermals): 15,17.55 15,11.73 arc45 15.59,10.31 18.61,7.29 arc-45 19.2,5.87 19.2,4.25 20.55,4.25 20.55,4.65 arc-90 22.55,6.65 26.75,6.65 26.75,11.7 20.5,11.7 arc-90 18.5,13.7 18.5,17.55
N$49  (via drill 0.3 pad 0.6)  (3 unrouted)
  other vias: 35.4,9.85 35.4,9.2 36.05,9.2 36.05,9.85
  pour Bottom: 36.3,10.05 35.2,10.05 35.2,9 36.3,9
  pour Top: 32.5,10.1 36.3,10.1 36.3,8.8 32.5,8.8
NAMUR0  (4 unrouted)
  Top 0.5: 11.25,69.65 C102.P$2 | C102.P$2 R103.P$2 R101.P$2 | C102.P$2 11.05,72.75 F101.1 11.25,77.65 20.7,77.65
NAMUR1  (4 unrouted)
  Top 0.5: 19.25,69.65 C202.P$2 | C202.P$2 R203.P$2 R201.P$2 | C202.P$2 19.05,72.75 F201.1 19.25,75.95 24,75.95
NAMUR8  (4 unrouted)
  Top 0.5: 75.25,69.65 C902.P$2 | C902.P$2 R903.P$2 R901.P$2 | C902.P$2 75.05,72.75 F901.1 75.25,82.2
NAMUR9  (4 unrouted)
  Top 0.5: 83.25,69.65 C1002.P$2 | C1002.P$2 R1003.P$2 R1001.P$2 | C1002.P$2 83.05,72.75 F1001.1 83.25,82.1
PGND  (via drill 0.3 pad 0.6)  (16 unrouted)
  other vias: 34.5,11.95 33.5,11.95 32.5,11.95 34.5,4.2 33.5,4.2 32.5,4.2 26,16.95 26,15.95 26,14.95 24.25,14.2 23.25,14.2 22.25,14.2 72.45,7.2 72.55,4.7 70,11.2 73.9,10.3 65.4,10.05
  pour Bottom (rank 3): 21.15,-0.05 74.5,-0.05 74.5,14.6 28,14.6 arc-90 26.5,16.1 26.5,17.6 21.15,17.6
  pour Top (rank 3): 21.15,-0.05 74.5,-0.05 74.5,14.6 28,14.6 arc-90 26.5,16.1 26.5,17.6 21.15,17.6
  pour Route15 (rank 3): 21.15,-0.05 74.5,-0.05 74.5,14.6 28,14.6 arc-90 26.5,16.1 26.5,17.6 21.15,17.6
  pour Route2 (rank 3): 21.15,-0.05 74.5,-0.05 74.5,14.6 28,14.6 arc-90 26.5,16.1 26.5,17.6 21.15,17.6
SW10
  pour Top (no thermals): 12.7,23.25 18.9,23.25 arc90 23.8,28.15 23.8,31.05 22.25,31.05 22.25,29.8 arc-90 19.1,26.65 14.2,26.65 12.7,25.15
SW11
  pour Top (no thermals): 151.2,50.15 151.2,56.35 arc90 146.3,61.25 143.4,61.25 143.4,59.7 144.65,59.7 arc-90 147.8,56.55 147.8,51.65 149.3,50.15
VDD_3V3  (via drill 0.3 pad 0.6)  (3 unrouted)
  other vias: 140.8,24.2 130.1,17.7 129.45,17.7 141.4,24.2
  pour Top (no thermals): 131.3,19.2 129,19.2 129,16.85 131.3,16.85
  pour Bottom (no thermals): 129.25,17.95 130.3,17.95 130.3,16.85 129.25,16.85
  pour Top (no thermals): 142.55,24.65 142.55,23.9 140.55,23.9 140.55,24.65
VDD_5V  (via drill 0.3 pad 0.6)  (8 unrouted)
  Top 1.5: v162.25,35.85 162.87,36.47 arc45 163.75,38.59 163.75,75.61 arc45 162.87,77.73 161.68,78.92 arc-45 160.77,81.12 160.77,99.21
  Bottom 0.2: 63.4,36 63.25,35.85
  other vias: 161.6,35.85 161,35.85 160.45,99.75 160.8,99.2 160.6,112.15 161.2,112.15 160.9,111.6
  pour Top (no thermals): 121.9,21.6 128.85,21.6 128.85,20.4 125.75,20.4 125.2,19.85 121.9,19.85
  pour Bottom: 162.9,35.2 160.65,35.2 160.65,36.5 162.9,36.5
  pour Top: 160.8,35.2 162.45,35.2 162.45,36.5 160.8,36.5
  pour Top: 160.12,98.8 161.43,98.8 161.43,100.1 160.12,100.1
  pour Bottom: 161.45,98.95 160.25,98.95 160.25,112.45 161.45,112.45
  pour Top (no thermals): 156.95,111.35 161.45,111.35 161.45,112.45 156.95,112.45
  pour Top (no thermals): 31.2,27.95 36.7,27.95 36.7,30.95 31.2,30.95
  pour Top (no thermals): 146.5,68.65 146.5,74.15 143.5,74.15 143.5,68.65

### Text on the board
tPlace: RLT508.02 | 1 | 2
tStop: EBCDSGN